# EAGLE design Main_PCB (EAGLE 8.4.1)
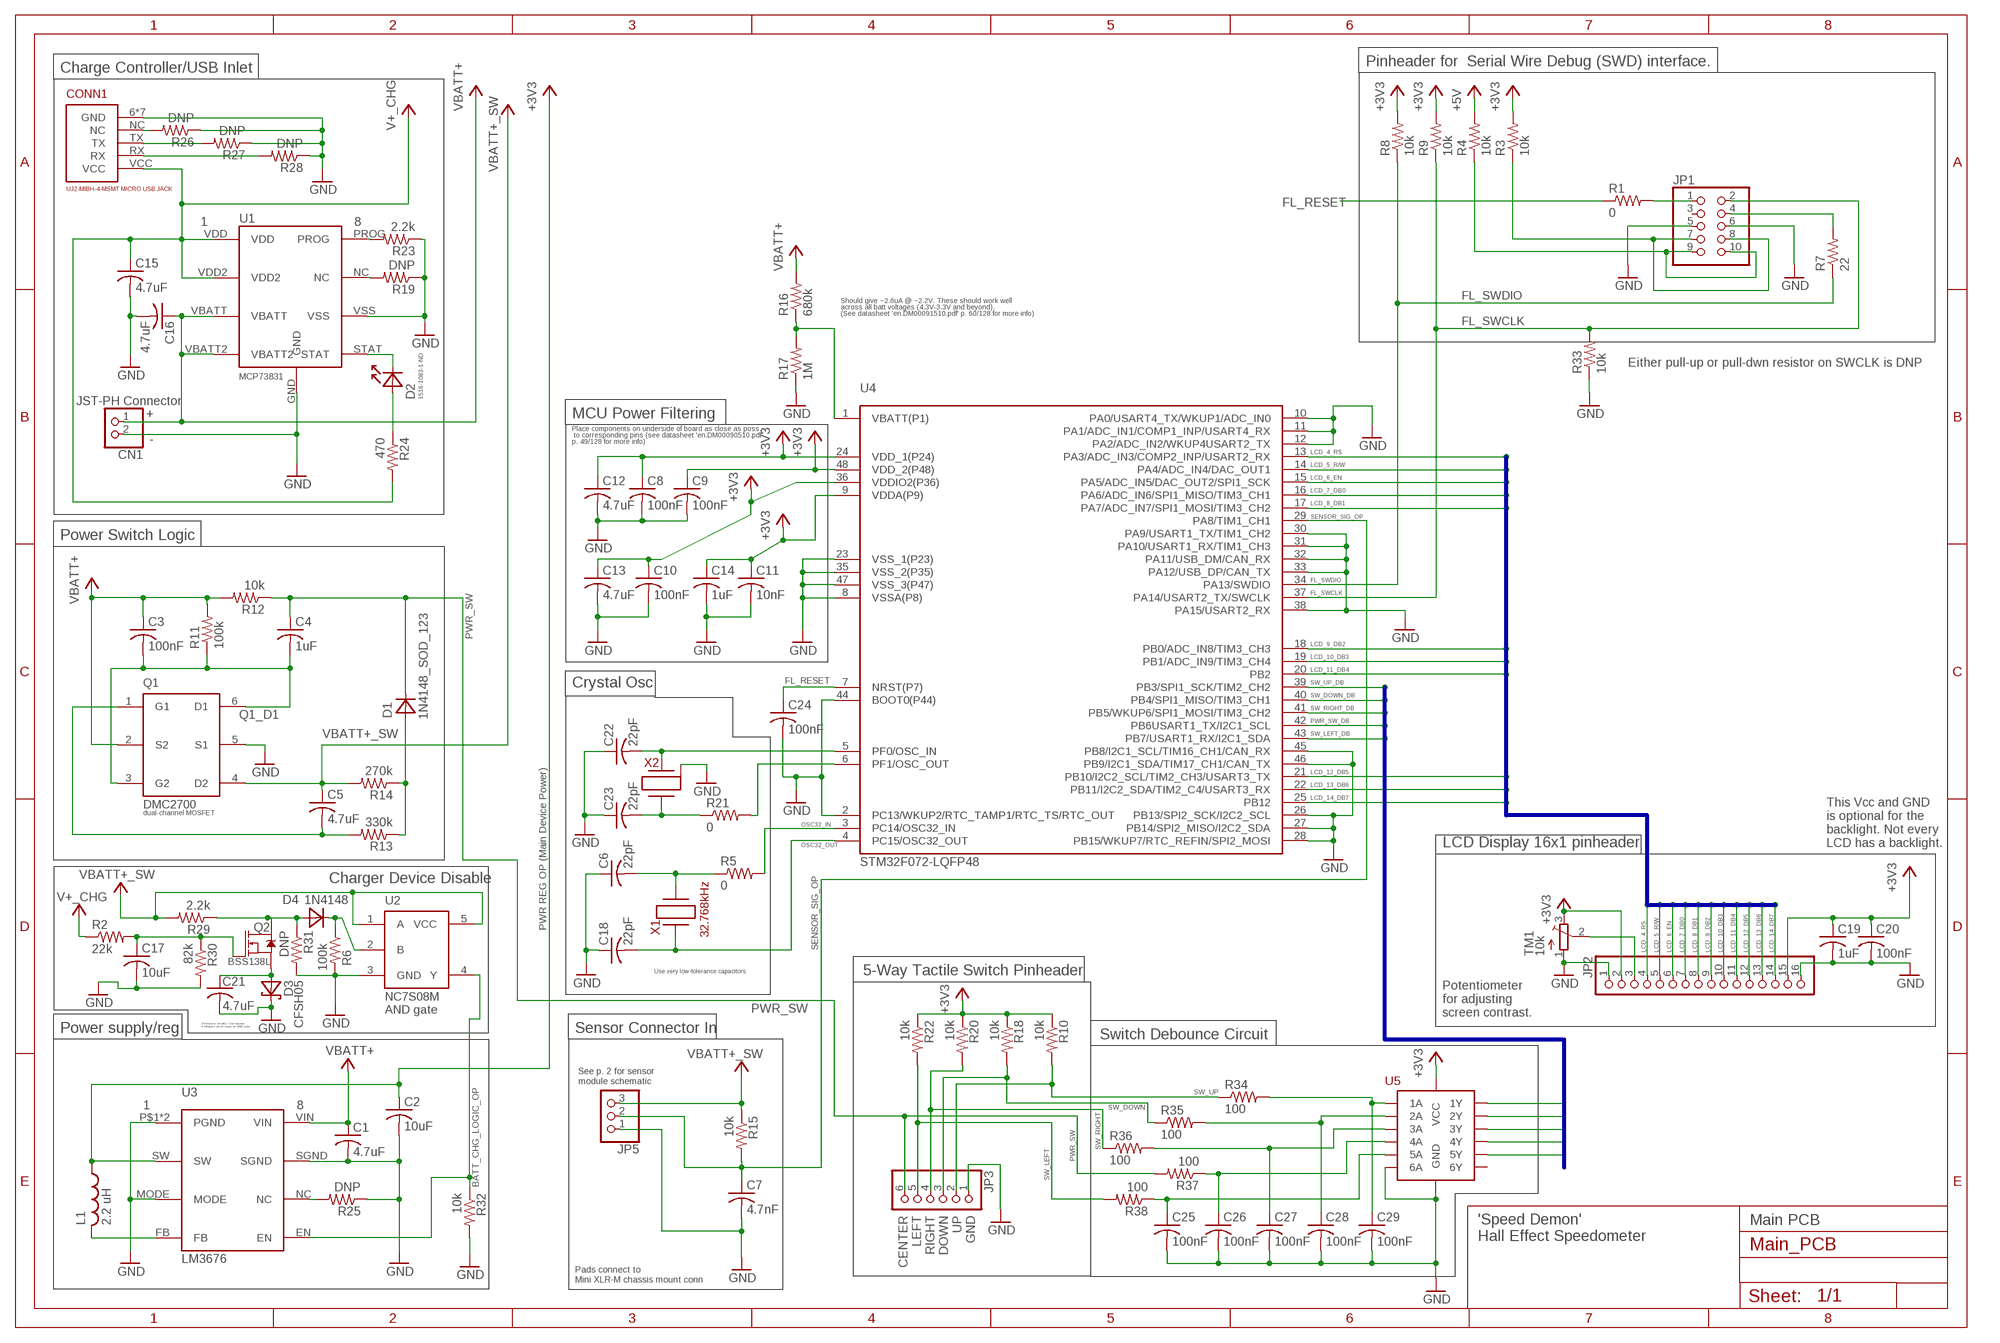
[diagram p0: schematic, sheet 1]

## Parts
C1  4.7uF  C_0805_NP  [C_0805]
C2  10uF  C_0805_NP  [C_0805]
C3  100nF  C_0805_NP  [C_0805]
C4  1uF  C_0805_NP  [C_0805]
C5  4.7uF  C_0805_NP  [C_0805]
C6  22pF  C_0805_NP  [C_0805]
C7  4.7nF  C_0805_NP  [C_0805]
C8  100nF  C_0805_NP  [C_0805]
C9  100nF  C_0805_NP  [C_0805]
C10  100nF  C_0805_NP  [C_0805]
C11  10nF  C_0805_NP  [C_0805]
C12  4.7uF  C_0805_NP  [C_0805]
C13  4.7uF  C_0805_NP  [C_0805]
C14  1uF  C_0805_NP  [C_0805]
C15  4.7uF  C_0805_NP  [C_0805]
C16  4.7uF  C_0805_NP  [C_0805]
C17  10uF  C_0805_NP  [C_0805]
C18  22pF  C_0805_NP  [C_0805]
C19  1uF  C_0805_NP  [C_0805]
C20  100nF  C_0805_NP  [C_0805]
C21  4.7uF  C_0805_NP  [C_0805]
C22  22pF  C_0805_NP  [C_0805]
C23  22pF  C_0805_NP  [C_0805]
C24  100nF  C_0805_NP  [C_0805]
C25  100nF  C_0805_NP  [C_0805]
C26  100nF  C_0805_NP  [C_0805]
C27  100nF  C_0805_NP  [C_0805]
C28  100nF  C_0805_NP  [C_0805]
C29  100nF  C_0805_NP  [C_0805]
CN1  JST_2PIN-SMT-RA  [JST-PH-2-SMT-RA]
CONN1  USB_JACK_102-4008-1-ND_USB-MICRO-B  [USB_JACK_102-4008-1-ND_UJ2-MIBH-4-MSMT-TR]
D1  1N4148_SOD_123  [D_SOD_123]
D2  LED_0805  [LED_0805]
D3  CFSH05  CFSH05_SCHOTTKY  [SOD-882]
D4  1N4148  1N4148_SOD_123  [D_SOD_123]
JP1  PINHD-2X5  [2X05]
JP2  PINHD-1X16  [1X16]
JP3  PINHD-1X6  [1X06]
JP5  PINHD-1X3  [1X03]
L1  2.2 uH  NRS4010T2R2MDGGV  [NONSTANDARD_IND]
Q1  DMC2700  DMC2700_SOT-23-6  [SOT-23-6]
Q2  BSS138L  BSS138LT1_TO-236  [TO-236]
R1  0  R-US_R0805  [R0805]
R2  22k  R_0805  [R_0805]
R3  10k  R-US_R0805  [R0805]
R4  10k  R-US_R0805  [R0805]
R5  0  R-US_R0805  [R0805]
R6  100k  R_0805  [R_0805]
R7  22  R-US_R0805  [R0805]
R8  10k  R-US_R0805  [R0805]
R9  10k  R-US_R0805  [R0805]
R10  10k  R_0805  [R_0805]
R11  100k  R_0805  [R_0805]
R12  10k  R_0805  [R_0805]
R13  330k  R_0805  [R_0805]
R14  270k  R_0805  [R_0805]
R15  10k  R_0805  [R_0805]
R16  680k  R_0805  [R_0805]
R17  1M  R_0805  [R_0805]
R18  10k  R_0805  [R_0805]
R19  DNP  R_0805  [R_0805]
R20  10k  R_0805  [R_0805]
R21  0  R_0805  [R_0805]
R22  10k  R_0805  [R_0805]
R23  2.2k  R_0805  [R_0805]
R24  470  R_0805  [R_0805]
R25  DNP  R_0805  [R_0805]
R26  DNP  R_0805  [R_0805]
R27  DNP  R_0805  [R_0805]
R28  DNP  R_0805  [R_0805]
R29  2.2k  R_0805  [R_0805]
R30  82k  R_0805  [R_0805]
R31  DNP  R_0805  [R_0805]
R32  10k  R_0805  [R_0805]
R33  10k  R-US_R0805  [R0805]
R34  100  R_0805  [R_0805]
R35  100  R_0805  [R_0805]
R36  100  R_0805  [R_0805]
R37  100  R_0805  [R_0805]
R38  100  R_0805  [R_0805]
TM1  10k  TRIMPOT3386  [TRIM-3386]
U1  MCP73831_8-DFN  [8-DFN-(2X3)]
U2  NC7S08M  NC7S08_SOT_23_5  [SOT-23-5]
U3  LM3676  [WSON]
U4  STM32F072-LQFP48  [LQFP48]
U5  SN74LV14A_HEX_SHMITT  [S-PVFQN-N14]
X1  32.768kHz  XC2292CT-ND  [CRYSTAL_OSC_3.2X1.5]
X2  ABM3B-8.000MHZ-10-D-1-G-T  [4-SMD]

## Nets
+3V3: C2.1 C8.1 C9.1 C10.1 C11.1 C12.1 C13.1 C14.1 C19.1 C20.1 JP2.2 JP2.15 L1.P$1 R3.2 R8.2 R9.2 R10.1 R18.1 R20.1 R22.1 TM1.3(E) U3.SW U4.9(VDDA(P9)) U4.24(VDD_1(P24)) U4.36(VDDIO2(P36)) U4.48(VDD_2(P48)) U5.P$14(VCC)
+5V: R4.2
+V+_CHG: C15.1 CONN1.VCC R2.1 R24.2 U1.VDD U1.VDD2 ; supply symbol labelled V+_CHG
BATT_CHG_LOGIC_OP: R32.1 U2.4(Y) U3.EN
FL_RESET: C24.1 R1.1 U4.7(NRST(P7))
FL_SWCLK: JP1.2 R9.1 R33.2 U4.37(PA14/USART2_TX/SWCLK)
FL_SWDIO: R7.1 R8.1 U4.34(PA13/SWDIO)
GND: C1.2 C2.2 C6.1 C7.2 C8.2 C9.2 C10.2 C11.2 C12.2 C13.2 C14.2 C15.2 C16.2 C17.2 C18.1 C19.2 C20.2 C21.2 C22.1 C23.1 C24.2 C25.2 C26.2 C27.2 C28.2 C29.2 CN1.2 CONN1.6(GND) CONN1.7(GND) CONN1.8(GND) CONN1.9(GND) CONN1.10(GND) CONN1.11(GND) CONN1.GND D3.P$2(C) JP1.5 JP1.6 JP2.1 JP2.16 JP3.1 JP5.1 Q1.5(S1) R6.2 R17.1 R19.1 R23.1 R25.1 R26.1 R27.1 R28.1 R30.2 R31.2 R32.2 R33.1 TM1.1(A) U1.GND U1.VSS U2.3(GND) U3.MODE U3.P$1(PGND) U3.PGND U3.SGND U4.2(PC13/WKUP2/RTC_TAMP1/RTC_TS/RTC_OUT) U4.8(VSSA(P8)) U4.10(PA0/USART4_TX/WKUP1/ADC_IN0) U4.11(PA1/ADC_IN1/COMP1_INP/USART4_RX) U4.12(PA2/ADC_IN2/WKUP4USART2_TX) U4.23(VSS_1(P23)) U4.26(PB13/SPI2_SCK/I2C2_SCL) U4.27(PB14/SPI2_MISO/I2C2_SDA) U4.28(PB15/WKUP7/RTC_REFIN/SPI2_MOSI) U4.30(PA9/USART1_TX/TIM1_CH2) U4.31(PA10/USART1_RX/TIM1_CH3) U4.32(PA11/USB_DM/CAN_RX) U4.33(PA12/USB_DP/CAN_TX) U4.35(VSS_2(P35)) U4.38(PA15/USART2_RX) U4.44(BOOT0(P44)) U4.45(PB8/I2C1_SCL/TIM16_CH1/CAN_RX) U4.46(PB9/I2C1_SDA/TIM17_CH1/CAN_TX) U4.47(VSS_3(P47)) U5.GND U5.P$7(GND) U5.P$13(6A) X2.P$02 X2.P$04
LCD_4_RS: JP2.4 U4.13(PA3/ADC_IN3/COMP2_INP/USART2_RX)
LCD_5_R/W: JP2.5 U4.14(PA4/ADC_IN4/DAC_OUT1)
LCD_6_EN: JP2.6 U4.15(PA5/ADC_IN5/DAC_OUT2/SPI1_SCK)
LCD_7_DB0: JP2.7 U4.16(PA6/ADC_IN6/SPI1_MISO/TIM3_CH1)
LCD_8_DB1: JP2.8 U4.17(PA7/ADC_IN7/SPI1_MOSI/TIM3_CH2)
LCD_9_DB2: JP2.9 U4.18(PB0/ADC_IN8/TIM3_CH3)
LCD_10_DB3: JP2.10 U4.19(PB1/ADC_IN9/TIM3_CH4)
LCD_11_DB4: JP2.11 U4.20(PB2)
LCD_12_DB5: JP2.12 U4.21(PB10/I2C2_SCL/TIM2_CH3/USART3_TX)
LCD_13_DB6: JP2.13 U4.22(PB11/I2C2_SDA/TIM2_C4/USART3_RX)
LCD_14_DB7: JP2.14 U4.25(PB12)
N$1: C5.2 Q1.1(G1) R13.2
N$2: JP1.1 R1.2
N$3: JP1.9 JP1.10 R4.1
N$5: R5.2 U4.3(PC14/OSC32_IN)
N$6: JP1.7 JP1.8 R3.1
N$7: R16.1 R17.2 U4.1(VBATT(P1))
N$9: JP1.4 R7.2
N$10: L1.P$2 U3.FB
N$11: D4.2(C) R6.1 U2.2(B)
N$13: R21.2 U4.6(PF1/OSC_OUT)
N$14: JP2.3 TM1.2(S)
N$15: D1.1(A) R13.1 R14.1
N$16: C17.1 Q2.1(G) R2.2 R30.1
N$17: C22.2 U4.5(PF0/OSC_IN) X2.P$01
N$18: C23.2 R21.1 X2.P$03
N$19: D4.1(A) Q2.3(D) R29.1 R31.1
N$20: C21.1 D3.P$1(A) Q2.2(S)
N$21: C25.1 R38.1 U5.P$11(5A)
N$22: C26.1 R37.1 U5.P$9(4A)
N$23: C27.1 R36.2 U5.P$5(3A)
N$24: C28.1 R35.2 U5.P$3(2A)
N$26: C29.1 R34.2 U5.P$1(1A)
N$31: D2.2(C) U1.STAT
N$32: R19.2 U1.NC
N$33: D2.1(A) R24.1
N$34: R23.2 U1.PROG
N$35: R25.2 U3.NC
N$36: CONN1.NC R26.2
N$38: CONN1.TX R27.2
N$39: CONN1.RX R28.2
OSC32_IN: C6.2 R5.1 X1.P$1
OSC32_OUT: C18.2 U4.4(PC15/OSC32_OUT) X1.P$2
PWR_SW: C4.1 D1.2(C) JP3.6 R12.1 R37.2
PWR_SW_DB: U4.42(PB6USART1_TX/I2C1_SCL) U5.P$8(4Y)
Q1_D1: C3.2 C4.2 Q1.3(G2) Q1.6(D1) R11.1
SENSOR_SIG_OP: C7.1 JP5.2 R15.2 U4.29(PA8/TIM1_CH1)
SW_DOWN: JP3.3 R18.2 R35.1
SW_DOWN_DB: U4.40(PB4/SPI1_MISO/TIM3_CH1) U5.P$4(2Y)
SW_LEFT: JP3.5 R22.2 R38.2
SW_LEFT_DB: U4.43(PB7/USART1_RX/I2C1_SDA) U5.P$10(5Y)
SW_RIGHT: JP3.4 R20.2 R36.1
SW_RIGHT_DB: U4.41(PB5/WKUP6/SPI1_MOSI/TIM3_CH2) U5.P$6(3Y)
SW_UP: JP3.2 R10.2 R34.1
SW_UP_DB: U4.39(PB3/SPI1_SCK/TIM2_CH2) U5.P$2(1Y)
VBATT+: C1.1 C3.1 C16.1 CN1.1 Q1.2(S2) R11.2 R12.2 R16.2 U1.VBATT U1.VBATT2 U3.VIN
VBATT+_SW: C5.1 JP5.3 Q1.4(D2) R14.2 R15.1 R29.2 U2.1(A) U2.5(VCC)
Unconnected: JP1.3 U5.P$12(6Y)

## Buses
LCD_4_RS,LCD_5_R/W,LCD_6_EN,LCD_7_DB0,LCD_8_DB1,LCD_9_DB2,LCD_10_DB3,LCD_11_DB4,LCD_12_DB5,LCD_13_DB6,LCD_14_DB7
SW_UP_DB,SW_DOWN_DB,SW_RIGHT_DB,SW_LEFT_DB,PWR_SW_DB

## Notes on the sheet
- Pinheader for  Serial Wire Debug (SWD) interface.
- Charge Controller/USB Inlet
- Should give ~2.6uA @ ~2.2V. These should work well
- across all batt voltages (4.3V-3.3V and beyond).
- (See datasheet 'en.DM00091510.pdf' p. 60/128 for more info)
- Either pull-up or pull-dwn resistor on SWCLK is DNP
- JST-PH Connector
- + | MCU Power Filtering
- Place components on underside of board as close as poss.
- to corresponding pins (see datasheet 'en.DM00090510.pdf'
- - | p. 49/128 for more info)
- Power Switch Logic
- Crystal Osc
- dual-channel MOSFET
- LCD Display 16x1 pinheader
- This Vcc and GND
  is optional for the
  backlight. Not every
  LCD has a backlight.
- Charger Device Disable
- PWR REG OP (Main Device Power)
- Use very low-tolerance capacitors.
- 5-Way Tactile Switch Pinheader
- Potentiometer
  for adjusting
  screen contrast.
- Debounce circuitry. Can bypass
  if voltages out of range for AND gate.
- Power supply/reg | Sensor Connector In
- Switch Debounce Circuit
- See p. 2 for sensor
  module schematic
- CENTER
  LEFT
  RIGHT
  DOWN
  UP
  GND
- Main PCB
- 'Speed Demon'
  Hall Effect Speedometer
- Pads connect to
  Mini XLR-M chassis mount conn

## Library data of the parts
C1-C5 C7-C17 C19-C21 C24-C29 = 0805_generics:C_0805_NP: generic capacitor in 0805 package
C6 C18 C22 C23 = LCRD_SMD_generics:C_0805_NP: generic capacitor in 0805 package
CN1 = adafruit:JST_2PIN: JST 2-Pin Connectors of various flavors SMT-RA (S2B-PH-SM4) 4UConnector #17311 SMT (B2B-PH-SM4) THM-RA (S2B-PH) THM (B2B-PH)
CONN1 = USB_micro_jack:USB_JACK_102-4008-1-ND_USB-MICRO-B
D1 D4 = LCRD_SMD_generics:1N4148_SOD_123
D2 = LCRD_SMD_generics:LED_0805
D3 = LCRD_SMD_generics:CFSH05_SCHOTTKY: schottky diode
JP1 = pinhead:PINHD-2X5: PIN HEADER
JP2 = pinhead:PINHD-1X16: PIN HEADER
JP3 = pinhead:PINHD-1X6: PIN HEADER
JP5 = pinhead:PINHD-1X3: PIN HEADER
L1 = LCRD_SMD_generics:NRS4010T2R2MDGGV: 2.2 uH inductor
Q1 = DMC2700:DMC2700_SOT-23-6
Q2 = DMC2700:BSS138LT1_TO-236
R1 R3-R5 R7-R9 R33 = rcl:R-US_: RESISTOR, American symbol
R2 R6 R10-R20 R22-R32 R34-R38 = 0805_generics:R_0805
R21 = LCRD_SMD_generics:R_0805
TM1 = adafruit:TRIMPOT: SMT trimmer potentiometer part number TC33X http://www.ladyada.net/library/eagle
U1 = mcp73831:MCP73831_8-DFN
U2 = DMC2700:NC7S08_SOT_23_5
U3 = LM3676:LM3676: Switching Power Regulator. LM3676 Created by Nathaniel Dusciuc (10/20/2017) for ECE411.
U4 = stm32f0:STM32F072
U5 = DMC2700:SN74LV14A_HEX_SHMITT
X1 = LCRD_SMD_generics:XC2292CT-ND: 32.768KHz crystal oscillator with 5ppm tolerance (~.0005% error) Part name is Digi-key part #. Mfr. Part # is ECS-.327-CDX-1293 load capacitance = 12.5pF To determine ext capacitors use fmla: CL = [(CL1 * CL@)/(CL1+CL2)] + Cs where Cs is stray capacitance from PCB
X2 = LCRD_SMD_generics:ABM3B-8.000MHZ-10-D-1-G-T: 8 MHZ crystal oscilator. CL = 10pF, ESR = 200 ohm

## Board
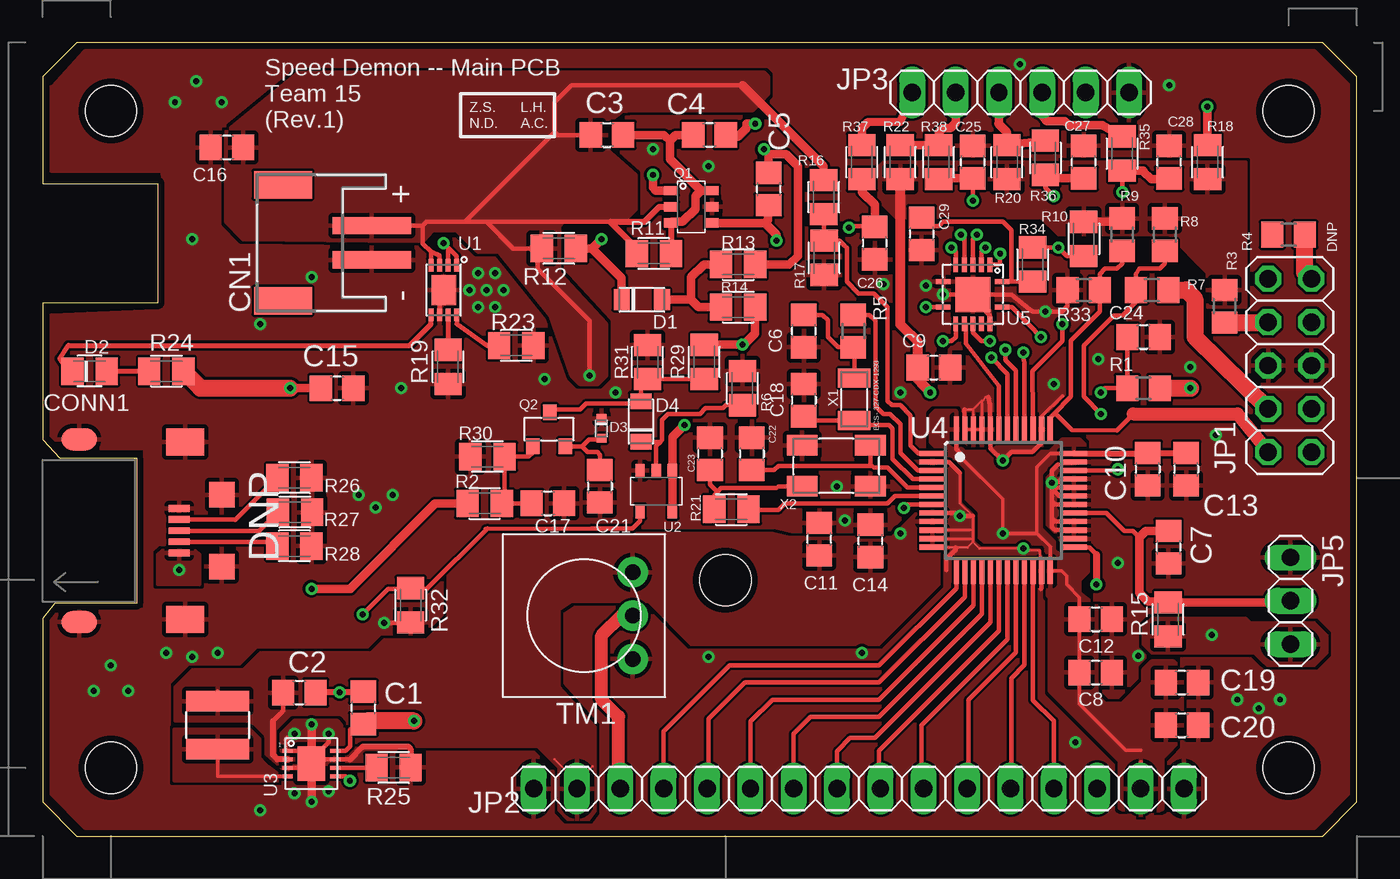
[diagram p1: board, top side]
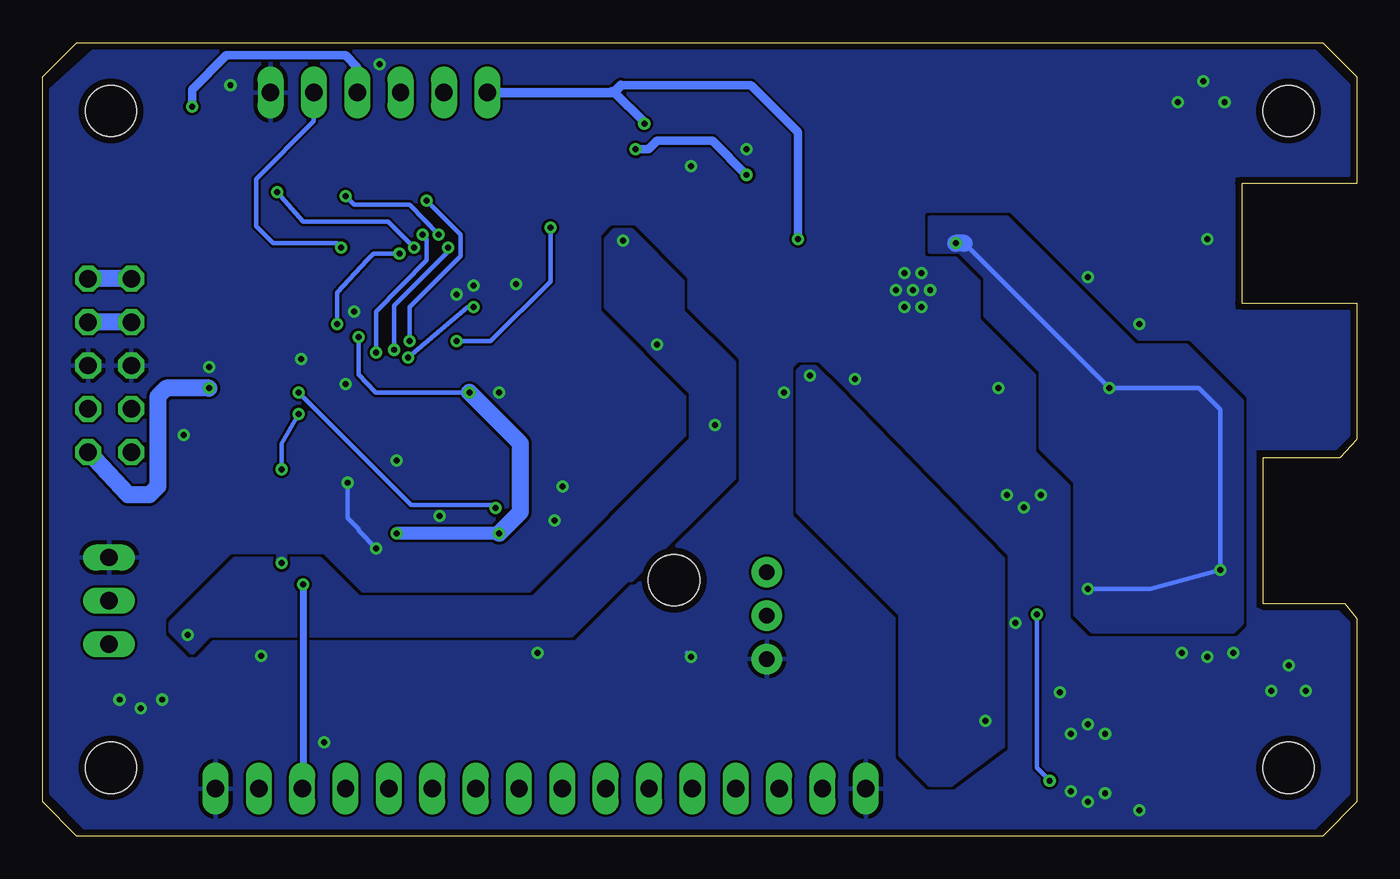
[diagram p2: board, bottom side, seen from below]

Size 77 x 46.5 mm. Coordinates in mm from the lower left corner, seen from the top.
Outline: 0,2 2,0 75,0 77,2 77,44.5 75,46.5 2,46.5 1,45.5 0,44.5 0,38.25 6.75,38.25 6.75,31.25 0,31.25 0,23.25 1,22.15 5.5,22.15 5.5,13.65 0.7,13.65 0,12.75 0,2
Copper layers (1*16): Top 0.0356mm / dielectric 1.5011mm / Bottom 0.0356mm
Design rules "LaenPCBOrder *": minimum track width 6mil, minimum drill 13mil, track to track 6mil, track to pad 6mil, pad to pad 6mil, via to via 6mil, smd to smd 6mil, copper to edge 15mil, drill to drill 6mil, minimum pad ring 7mil, minimum via ring 7mil, stop-mask expansion 3mil, vias tented up to drill 0mil, thermal gap 10mil
Holes 3 mm at 4,4 4,42.5 73,42.5 73,4 40,15

### Footprints (pad centres in the part's own frame; a part is rotated, then mirrored left to right if it is on the bottom)
C_0805 = smd 1.3 x 1.5: 1 -0.95,0; 2 0.95,0
JST-PH-2-SMT-RA = smd 1 x 4.6: 1 1,-3.7; 2 -1,-3.7 | smd 1.6 x 3.4: NC1 -3.4,1.5; NC2 3.4,1.5
USB_JACK_102-4008-1-ND_UJ2-MIBH-4-MSMT-TR = smd 2.1 x 1.3: 6 0,5.35; 11 0,-5.35 | smd 2.2 x 1.6: 7 6.2,5.2; 10 6.2,-5.2 | smd 1.5 x 1.5: 8 8.35,2.1; 9 8.35,-2.1 | smd 1.25 x 0.4: GND 5.85,1.3; NC 5.85,0.65; RX 5.85,-0.65; TX 5.85,0; VCC 5.85,-1.3
D_SOD_123 = smd 0.914 x 1.219: 1 -1.181,0; 2 1.181,0
LED_0805 = smd 1.3 x 1.6: 1 -1,0; 2 1,0
SOD-882 = smd 0.5 x 0.6: P$1 -0.575,0; P$2 0.575,0
2X05 = drill 1.016 octagon: 1 -5.08,-1.27; 2 -5.08,1.27; 3 -2.54,-1.27; 4 -2.54,1.27; 5 0,-1.27; 6 0,1.27; 7 2.54,-1.27; 8 2.54,1.27; 9 5.08,-1.27; 10 5.08,1.27
1X16 = drill 1.016 long: 1 -19.05,0; 2 -16.51,0; 3 -13.97,0; 4 -11.43,0; 5 -8.89,0; 6 -6.35,0; 7 -3.81,0; 8 -1.27,0; 9 1.27,0; 10 3.81,0; 11 6.35,0; 12 8.89,0; 13 11.43,0; 14 13.97,0; 15 16.51,0; 16 19.05,0
1X06 = drill 1.016 long: 1 -6.35,0; 2 -3.81,0; 3 -1.27,0; 4 1.27,0; 5 3.81,0; 6 6.35,0
1X03 = drill 1.016 long: 1 -2.54,0; 2 0,0; 3 2.54,0
NONSTANDARD_IND = smd 1.2 x 3.7: P$1 -1.4,0; P$2 1.4,0
SOT-23-6 = smd 0.55 x 0.8: 1 -0.95,-1.2; 2 0,-1.2; 3 0.95,-1.2; 4 0.95,1.2; 5 0,1.2; 6 -0.95,1.2
TO-236 = smd 0.8 x 0.9: 1 -0.95,-1; 2 0.95,-1; 3 0.05,1
R0805 = smd 1.3 x 1.5: 1 -0.95,0; 2 0.95,0
R_0805 = smd 1.3 x 1.6: 1 -1,0; 2 1,0
TRIM-3386 = drill 0.9 pad 1.778: 1 -2.54,-2.857; 2 0,-2.857; 3 2.54,-2.857
8-DFN-(2X3) = smd 1.45 x 1.75: GND 0,0 | smd 0.3 x 0.75: NC -0.25,1.45; PROG -0.75,1.45; STAT 0.75,1.45; VBATT 0.25,-1.45; VBATT2 0.75,-1.45; VDD -0.75,-1.45; VDD2 -0.25,-1.45; VSS 0.25,1.45
SOT-23-5 = smd 0.55 x 0.8: 1 -0.95,-1.2; 2 0,-1.2; 3 0.95,-1.2; 4 0.95,1.2; 5 -0.95,1.2
WSON = smd 0.6 x 0.25: EN 1.4,-0.75; FB -1.4,-0.75; MODE -1.4,-0.25; NC 1.4,-0.25; PGND -1.4,0.75; SGND 1.4,0.25; SW -1.4,0.25; VIN 1.4,0.75 | smd 1.6 x 2: P$1 0,0
LQFP48 = smd 1.5 x 0.3: 1 -4.15,2.75; 2 -4.15,2.25; 3 -4.15,1.75; 4 -4.15,1.25; 5 -4.15,0.75; 6 -4.15,0.25; 7 -4.15,-0.25; 8 -4.15,-0.75; 9 -4.15,-1.25; 10 -4.15,-1.75; 11 -4.15,-2.25; 12 -4.15,-2.75; 25 4.15,-2.75; 26 4.15,-2.25; 27 4.15,-1.75; 28 4.15,-1.25; 29 4.15,-0.75; 30 4.15,-0.25; 31 4.15,0.25; 32 4.15,0.75; 33 4.15,1.25; 34 4.15,1.75; 35 4.15,2.25; 36 4.15,2.75 | smd 0.3 x 1.5: 13 -2.75,-4.15; 14 -2.25,-4.15; 15 -1.75,-4.15; 16 -1.25,-4.15; 17 -0.75,-4.15; 18 -0.25,-4.15; 19 0.25,-4.15; 20 0.75,-4.15; 21 1.25,-4.15; 22 1.75,-4.15; 23 2.25,-4.15; 24 2.75,-4.15; 37 2.75,4.15; 38 2.25,4.15; 39 1.75,4.15; 40 1.25,4.15; 41 0.75,4.15; 42 0.25,4.15; 43 -0.25,4.15; 44 -0.75,4.15; 45 -1.25,4.15; 46 -1.75,4.15; 47 -2.25,4.15; 48 -2.75,4.15
S-PVFQN-N14 = smd 2.05 x 2.05: GND 0,0 | smd 0.28 x 0.85: P$1 -0.75,1.725; P$7 -0.75,-1.725; P$8 0.75,-1.725; P$14 0.75,1.725 | smd 0.85 x 0.28: P$2 -1.725,1; P$3 -1.725,0.5; P$4 -1.725,0; P$5 -1.725,-0.5; P$6 -1.725,-1; P$9 1.725,-1; P$10 1.725,-0.5; P$11 1.725,0; P$12 1.725,0.5; P$13 1.725,1
CRYSTAL_OSC_3.2X1.5 = smd 1.1 x 1.9: P$1 1.25,0; P$2 -1.25,0
4-SMD = smd 1.8 x 1.2: P$01 -2,-1.2; P$02 2,-1.2; P$03 2,1.2; P$04 -2,1.2

### Placement (x,y rotation side)
C1  18.79,7.52 90 top
C2  15.04,8.41 0 top
C3  33.06,41.09 0 top
C4  39.07,41.09 180 top
C5  42.54,37.92 90 top
C6  44.6,29.6 90 top
C7  65.96,16.93 270 top
C8  61.7,9.59 0 top
C9  52.22,27.46 0 top
C10  64.75,21.5 270 top
C11  45.5,17.4 90 top
C12  61.7,12.71 0 top
C13  67,21.5 270 top
C14  48.5,17.3 90 top
C15  17.25,26.25 0 top
C16  10.8,40.35 180 top
C17  29.6,19.5 0 top
C18  44.6,25.55 270 top
C19  66.75,9 0 top
C20  66.75,6.5 0 top
C21  32.65,20.5 270 top
C22  41.55,22.4 270 top
C23  39.1,22.4 270 top
C24  64.5,29.25 0 top
C25  54.5,39.5 90 top
C26  48.75,34.75 270 top
C27  61,39.5 90 top
C28  66,39.5 90 top
C29  51.5,35.3 270 top
CN1  15.58,34.77 90 top
CONN1  2.15,17.9 0 top
D1  35.11,31.44 180 top
D2  2.75,27.25 180 top
D3  32.75,23.9 90 top
D4  35.05,24.3 270 top
JP1  73.07,27.58 90 top
JP2  47.82,2.78 0 top
JP3  57.3,43.58 180 top
JP5  73.11,13.79 270 top
L1  10.25,6.5 270 top
Q1  38.01,36.88 270 top
Q2  29.67,23.84 0 top
R1  64.5,26.25 0 top
R2  25.9,19.5 0 top
R3  69.25,31.05 90 top
R4  73,35.25 180 top
R5  47.5,29.6 90 top
R6  41,26.25 90 top
R7  65,32 0 top
R8  65.75,35.25 90 top
R9  63.25,35.25 90 top
R10  61,35 270 top
R11  35.81,34.14 180 top
R12  30.24,34.44 180 top
R13  40.75,33.5 0 top
R14  40.75,31 0 top
R15  65.94,12.7 90 top
R16  45.77,37.45 90 top
R17  45.79,33.89 90 top
R18  68.25,39.5 90 top
R19  23.75,27.5 90 top
R20  56.5,39.5 90 top
R21  40.35,19.15 0 top
R22  50.25,39.5 90 top
R23  27.75,28.75 180 top
R24  7.25,27.25 0 top
R25  20.56,4.02 180 top
R26  14.75,21 180 top
R27  14.78,18.98 180 top
R28  14.75,17 180 top
R29  38.77,27.79 90 top
R30  26.06,22.24 180 top
R31  35.44,27.78 90 top
R32  21.56,13.53 270 top
R33  61,32 0 top
R34  58,33.5 270 top
R35  63.25,40 270 top
R36  58.75,39.75 270 top
R37  48,39.5 90 top
R38  52.5,39.5 90 top
TM1  31.71,12.92 90 top
U1  23.5,32 180 top
U2  35.95,20.22 180 top
U3  15.75,4.25 0 top
U4  56.28,19.68 0 top
U5  54.5,31.75 270 top
X1  47.55,25.6 90 top
X2  46.5,21.7 180 top

### Tracks (layer width: path | path; a pad name or v marks a point on that pad's centre or on a via)
+3V3  (via drill 0.35)
  Top 0.152: 30,4.5 31.31,3.19 31.31,3 | 32.21,4.09 31.93,3.81 31.8,3.68 31.8,3.63
  Top 0.2: 58.25,17.75 v56.25,17.75 56.25,19.75 53.75,22.25 53.75,22.46 | 58.25,17.75 58.25,21.63 59.06,22.43 U4.36 | 58.25,17.75 59.03,16.97 U4.24 59.72,15.53 60,15.25 60,14.75 60.75,14 C12.1 C8.1 60.75,7.75 63.47,5.03 64.33,5.03 | C2.1 14.25,8.5 | 10.25,8.5 L1.P$1 | 14.23,4.62 U3.SW | 31.31,3 JP2.2
  Top 0.203: 59,15.5 U4.24 | JP2.2 31.31,3.19 31.93,3.81
  Top 0.25: U4.36 | 64.73,22.43 C10.1 | C14.1 48.55,16.5 | U4.48 53.53,22.68 53.75,22.46 | 13.5,6.75 14.09,7.34 C2.1 | 64.33,4.32 JP2.15 | v58.5,29.25 57.05,30.75 56.8,31 U5.P$14 | R9.2 63.05,36
  Top 0.35: U4.36 64.73,22.43 | C10.1 C13.1 | U3.SW 13.75,4.5 13.5,4.75 13.5,6.75
  Top 0.5: 63.05,36 R10.1
  Top 0.6: R22.1 50.25,30 50.35,29.89 51.27,28.97 C9.1 51.27,26.77 v52,26
  Bottom 0.25: v52,26 57.5,26 58.5,27.05 v58.5,29.25
  Bottom 0.75: v50.25,17.75 v56.25,17.75
  Bottom 1: v50.25,17.75 49,19 49,23 v52,26
  pour Top (rank 2): 42.75,17.75 27,17.75 26.81,17.75 26.54,17.74 26.25,17.74 23.75,15.25 23.75,12.75 22.5,11.5 20,11.5 19.25,10.75 12.75,10.75 11.75,9.75 8.75,9.75 7.75,8.75 7.75,6.75 12.15,6.75 13.1,5.8 13.1,4.8 13.75,4.25 14,4.25 14.75,3.25 20.5,3.25 20.5,5.25 29,5.25 30.25,4 30.25,1.5 30.75,1 32,1 32.35,1.45 32.35,6.4 30.25,8.75 30.25,13.25 31,13.75 35.5,13.75 38,11.25 49,11.25 52.5,14.75 52.5,19 51.25,19 49.75,17.5 43.75,17.5
  pour Top (rank 2): 53.6,22.9 53.6,24.8 53.5,24.9 52.3,24.9 52.05,24.65 52.05,23.1 52.35,22.8 53.05,22.8 53.15,22.7 53.15,16.6 53.25,16.5 58.75,16.5 58.9,16.35 58.9,14.1 59,14 59,8.5 63.1,4.4 63.1,1.65 64,1.25 64.75,1.25 65.6,1.6 65.6,4.6 66.75,5.75 66.75,9.75 66.25,10.25 65,10.25 64.5,9.75 64.5,9 63.25,7.75 62.25,7.75 61.75,8.25 61.75,13.5 60.75,14.25 60.75,15 61.25,15.5 61.25,16.5 59.5,16.5 59.25,16.75 59.25,17.25 58.5,18 58.5,21.25 59.6,22.35 60.85,22.35 61.25,22.75 60.75,23.25 59.75,23.25 59,22.5 54,22.5
  pour Top: 66,35.25 59.5,35.25 58.5,36.25 50,36.25 49,37.25 49,39.25 49.25,39.5 70.5,39.5 70.5,31 68.25,31 68.25,33
+V+_CHG  (via drill 0.35)
  Top 0.25: U1.VDD2 23.75,34.5 v23.5,34.75 24.25,34 U1.VDD | 7.97,15.63 v8,15.6
  Top 0.5: v14.5,26.25 C15.1 | v15.75,14.5 18,14.5 | 18,14.5 18.03,14.5 | 18,14.5 23,19.5 R2.1
  Top 1: R24.2 9.25,26.25 v14.5,26.25
  Bottom 0.25: v15.75,14.5 12.1,14.5 v8,15.6 8,25 9.25,26.25 v14.5,26.25 23,34.75
  Bottom 1: 23,34.75 v23.5,34.75
  pour Bottom: 16.5,20.75 16.5,13 15.5,12 7.25,12 6.75,12.5 6.75,25.5 10,28.75 13,28.75 20.5,36.25 25,36.25 25,34.25 23.25,34.25 21.75,32.75 21.75,30.5 18.5,27.25 18.5,22.75
  pour Top: 7,16.75 8.95,16.75 9.2,16.5 9.2,14.75 6.75,14.75 6.75,16.5
BATT_CHG_LOGIC_OP  (via drill 0.35)
  Top 0.25: U2.4 34.99,18.46 34.57,18.04 32.17,18.03 25.95,18.01 26.06,18.02 22.5,14.5 R32.1 21.53,14.5 20.25,14.5 v18.75,13 | U3.EN 17.75,3.5 v18,3.25
  Bottom 0.25: v18.75,13 18.75,4 v18,3.25
FL_RESET  (via drill 0.35)
  Top 0.25: v62,26 62.25,26.25 R1.1 C24.1 | v50.47,19.22 50.68,19.43 U4.7
  Bottom 0.152: v50.47,19.22 50.66,19.42 50.64,19.4
  Bottom 0.25: v62,26 55.4,19.4 50.64,19.4
FL_SWCLK
  Top 0.25: 59.25,24.75 60.25,25.75 60.25,29.05 61.95,30.75 R33.2 61.95,32.95 62.25,33.25 62.95,33.25 63.25,33.55 R9.1 | 59.25,24.75 59,24.5 59,23.86 U4.37 | 59.25,24.75 59.36,24.75 60.3,23.79 62.92,23.78 63.89,24.75
  Top 0.75: 63.89,24.75 70,24.75 JP1.2
FL_SWDIO  (via drill 0.35)
  Top 0.25: v62,24.75 61,25.75 61,28.75 62.75,30.5 63.25,30.5 64.05,31.3 R7.1 64.05,32.95 64.25,33.25 65.45,33.25 65.75,33.55 R8.1 | v63,21.5 62.68,21.43 U4.34
  Bottom 0.25: v62,24.75 63,23 v63,21.5
GND  (via drill 0.35)
  Top 0.152: U4.23 58.53,16.22 58.5,16.25 58.5,16.35 58.43,16.43 58.43,16.72 58.4,16.75 57.57,16.75 v57.46,16.86 54.89,16.86 54.5,17.25 | 54.5,17.5 54.5,18 | 54.5,17.5 54.5,17.25 | 54.5,18 54.5,18.75 53.75,19.5 53.75,21.27 | 59.48,21.77 59.55,21.77 59.59,21.81 60.31,21.81 U4.35 | U4.10 54.43,17.93 54.5,18 | U4.12 54.18,16.93 54.5,17.25 | U4.11 54.43,17.43 54.5,17.5 | U4.46 54.53,24.97 54.5,25 | 54.5,25 54,25 | 55.03,25.47 U4.45 | 55.03,25.47 55,25.5 54.5,25 | 55.42,25.72 55.28,25.72 55.03,25.47 | U4.46 U4.45 | U4.46 U4.47
  Top 0.2: U3.PGND 14.25,5.1 14.25,5.64 | U4.38 58.53,24.59 59.74,25.8 59.77,25.8
  Top 0.25: U3.P$1 16.25,4.25 16.5,4.5 U3.SGND 18,4.5 | U3.MODE 15,4 15.25,4.25 U3.P$1 | U3.P$1 15.75,3.38 | U1.VSS 23.25,31.5 23.5,31.75 U1.GND | v59.13,20.71 59.13,21.42 59.48,21.77 | 55.53,24.47 55.5,24.5 55.5,25.28 55.42,25.72 | 56.53,22.28 v56.25,22 | U4.38 58.53,23.03 58,22.5 56.75,22.5 v56.25,22 | v59.13,20.71 59.47,20.71 59.69,20.93 U4.33 | v59.13,20.71 59.13,20.37 | U4.31 59.57,19.93 59.56,19.93 59.25,20.25 | 59.13,20.37 59.25,20.25 | 59.25,20.25 59.43,20.43 U4.32 | 59.13,20.37 59.13,19.62 | U4.30 59.32,19.43 59.13,19.62 | 59.13,19.62 59.13,18.62 | U4.28 59.32,18.43 59.13,18.62 | 59.13,18.62 59.13,18.12 59.32,17.93 U4.27 | 53.75,21.27 53.09,21.93 U4.2 | v56.25,22 55.53,22.72 U4.44 | 18.73,8.41 C1.2 | 14.94,5 U3.PGND | 54.5,18.75 v53.75,18.75 53.57,18.93 U4.8 | U4.23 58.53,14.53 58.5,14.5 | 53.5,16.93 53.5,16.8 52.95,16.25 52.95,15.6 | 21.56,4.44 R25.1 | 14.25,5.64 14.61,6 v14.75,6 | v16.75,6 16.75,5.5 15.75,4.5 U3.P$1 | R32.2 21.53,12.5 v20,12.5 | U4.45 | U4.47 54,23.86 54,25 | 54.25,31.75 v52.75,31.75 | 54.25,31.75 U5.GND 56.75,31.75 58,30.75 v58.75,30.75 59.75,30.75 60.05,31.05 R33.1 | U5.P$13 55.5,30.5 54.25,31.75
  Top 0.35: 18,4.5 18.75,5.25 21.42,5.25 21.56,5.11 21.56,4.44 | C2.2 v17.39,8.42 18.74,8.42 C1.2
  Top 0.5: v15.75,2 U3.P$1 v15.75,6.56
  Bottom 0.25: v57.46,16.86 58.5,17.9 58.5,18 59.13,18.63 v59.13,20.71 | v39,10.5 39.25,10.75
  other vias: 16.75,2.62 25,32 26,32 27,32 9,44.25 8.75,35 12.75,1.5 14.75,2.5 19.5,19.25 21,26.25 71.25,7.5 25.5,33 25.5,31 26.5,31 26.5,33 7.75,43 10.5,43 20.5,20 18.5,20 46.54,20.48 72.5,8 70,8 3,8.5 4,10 5,8.5 68.75,23.5 8.75,10.5 10.25,10.75 7.25,10.75 12.75,30 15.75,32.75 48,10.75 63,16 39,39.25 33.57,25.99 67.25,27.5 29.4,26.8 47,18.5 66,44 57.25,45.25 64.2,10.55 60.5,5.5 49.25,32.35 51.75,32.25 59.25,26.5 50.25,26 61.85,27.95 35.75,40.25
  pour Bottom (rank 3): 2.5,0.5 0.5,2.5 0.5,12.5 1.25,13.25 6,13.25 6,22.75 1.25,22.75 0.5,23.5 0.5,30.75 7.25,30.75 7.25,38.75 0.5,38.75 0.5,44 2.5,46 74,46 76.5,43.75 76.5,2.5 74.5,0.5
  pour Top (rank 3): 0.5,23.5 0.5,30.5 6,30.75 7.25,31 7.25,37.75 7,39 0.5,39 0.5,43.9 0.6,43.9 2.5,46 74.5,46 76.5,44 76.5,2.5 74.5,0.5 2.5,0.5 0.5,2.5 0.5,13 0.75,13.25 6,13.25 6,22.75 1.25,22.75
  pour Top: 53.25,21.75 53.75,21.25 53.75,19.5 54.5,18.75 54.5,17.25 54.9,16.85 57.5,16.85 57.6,16.75 58.35,16.75 58.4,16.7 58.4,16.45 58.5,16.35 58.5,16.2 58.1,16.6 53.15,16.6 52.8,16.95 53.15,17.3 53.15,17.8 53.15,21.65
  pour Top: 17.5,4.5 17.5,6.5 17.25,6.75 14.75,6.75 14,6 14,5 15.25,5 15.75,4.5
LCD_4_RS
  Top 0.25: U4.13 53.53,14.53 49,10 40.25,10 36.39,6.14 JP2.4
LCD_5_R/W
  Top 0.25: JP2.5 39,2.85 39,6.86 41.15,9 49,9 54.03,14.03 U4.14
LCD_6_EN
  Top 0.25: U4.15 54.53,13.53 49,8 42.75,8 41.47,6.72 JP2.6
LCD_7_DB0
  Top 0.25: U4.16 55.03,13.03 49,7 45,7 44,6 JP2.7
LCD_8_DB1
  Top 0.25: U4.17 55.53,12.53 48.75,5.75 47.31,5.75 46.56,5 46.55,4.95 JP2.8
LCD_9_DB2
  Top 0.25: U4.18 56.03,12.03 49,5 49,2.87 JP2.9
LCD_10_DB3
  Top 0.25: U4.19 56.53,11.53 51.5,6.5 51.5,2.91 JP2.10
LCD_11_DB4
  Top 0.25: U4.20 57.03,10.78 54.25,8 54.25,2.86 JP2.11
LCD_12_DB5
  Top 0.25: U4.21 57.53,10.03 56.75,9.25 56.75,2.82 JP2.12
LCD_13_DB6
  Top 0.25: U4.22 58.03,7.97 59.25,6.75 JP2.13
LCD_14_DB7  (via drill 0.35)
  Top 0.25: U4.25 61.32,16.93 61.75,16.5
  Top 0.4: 61.75,16.5 v61.75,14.75
  Bottom 0.25: 61.75,2.82 JP2.14
  Bottom 0.4: v61.75,14.75 61.75,2.82
N$1  (via drill 0.35)
  Top 0.5: Q1.1 35.92,37.83 35.75,38 v35.75,38.75 | C5.2 42.54,39.96 | v42.25,40.25 42.54,39.96 | 42.54,39.96 43.54,39.96 44.25,39.25 44.25,34 43.73,33.48 R13.2
  Bottom 0.5: v35.75,38.75 37.75,40.75 41,40.75 41.5,40.25 v42.25,40.25
N$2  (via drill 0.35)
  Top 1: R1.2 v67.25,26.25
  Bottom 1: v67.25,26.25 69.75,26.25 70.25,25.75 70.25,20.5 70.75,20 72,20 JP1.1
N$3
  Top 1: JP1.9 73.95,33.05 R4.1
  Bottom 1: JP1.10 JP1.9
N$5
  Top 0.25: U4.3 51.27,21.43 50.25,22.45 50.25,24.15 49.65,24.75 49.25,24.75 48.8,25.2 48.8,30.2 48.45,30.55 R5.2
N$6
  Top 1: R3.1 71.78,30.1 JP1.8
  Bottom 1: JP1.8 JP1.7
N$7
  Top 0.25: U4.1 51.32,22.43 50.85,22.9 50.85,24.65 50.25,25.25 49.75,25.25 49.5,25.5 49.5,31 48.7,31.8 47.81,31.8 47.12,32.49 47.12,34.48 47.01,34.59 46.69,34.89 R17.2 45.77,34.81 R16.1
N$9
  Top 1: R7.2 67,32 67.5,31.5 67.51,29.25 JP1.4
N$10
  Top 0.2: U3.FB 10.25,3.5 L1.P$2
  pour Top: 14.25,3.5 14,3.25 7.72,3.25 7.72,6.25 12.15,6.25 12.7,5.7 12.7,4.6 13.05,4.25 13,4.25 14,3.5
N$11
  Top 0.25: R6.1 40.05,25.25 39.88,25.07 38.83,25.07 38.5,24.75 36.65,24.75 36.3,24.4 36.3,23.2 36.2,23.1 | 35.5,22.97 D4.2 35.07,23.1 36.2,23.1 | 36.2,23.1 35.95,22.85 U2.2
N$13
  Top 0.25: R21.2 41.4,19.1 43.1,19.1 43.5,19.5 49.5,19.5 49.93,19.93 U4.6
N$14
  Top 0.25: 33.75,2.88 JP2.3
  Top 0.75: 33.75,2.88 33.75,7 32.75,8 32.75,11.75 33.92,12.92 TM1.2
N$15
  Top 0.5: R13.1 38.75,33.5 38,32.75 37.99,31.44 | 37.99,31.44 38.43,31 R14.1 | D1.1 37.99,31.44
N$16
  Top 0.25: 26.9,22.08 R30.1 | R30.1 28.48,22.25 28.72,22.49 Q2.1 | R30.1 27.06,19.66 R2.2 C17.1
N$17
  Top 0.25: X2.P$01 48.5,21.8 48.6,21.7 | 48.6,21.7 48.7,21.6 49.5,21.6 50.67,20.43 U4.5 | C22.2 42.85,21.45 43.1,21.7 48.6,21.7
N$18
  Top 0.25: X2.P$03 43.1,20.5 43,20.4 39.75,20.4 39.52,20.18 | 39.52,20.18 39.35,20 R21.1 | 39.52,20.18 39.1,20.6 C23.2
N$19
  Top 0.152: 35.44,25.39 D4.1
  Top 0.25: Q2.3 29.88,25 31.5,25 31.84,25.34 35.16,25.34 | R29.1 R31.1 35.05,26.39 D4.1 35.16,25.34 | 35.16,25.34 35.27,25.2 | 35.16,25.34
N$20
  Top 0.25: Q2.2 31.59,22.84 | 31.59,22.84 32,23.25 32.67,23.25 D3.P$1 | 31.59,22.84 31.93,22.5 32.5,22.5 32.65,22.35 C21.1
N$21  (via drill 0.35)
  Top 0.25: U5.P$11 54.5,29.5 55,29 v55.5,29 | v54.5,37.25 C25.1
  Top 0.5: R38.1 52.55,38.55 C25.1
  Bottom 0.25: v55.5,29 55.5,31 52.5,34 52.5,35.25 v54.5,37.25
N$22  (via drill 0.35)
  Top 0.25: U5.P$9 53.5,29.25 53.25,29 v52.75,29 | v47.25,35.65 47.35,35.75 48.75,35.75
  Top 0.5: R37.1 48,37.75 48.75,37 48.75,35.75 C26.1
  Bottom 0.25: v52.75,29 50.75,29 47.25,32.5 v47.25,35.65
N$23  (via drill 0.35)
  Top 0.25: R36.2 58.75,38 v59.25,37.5 | U5.P$5 54,35.05 v53.8,35.25
  Top 0.5: R36.2 58.8,38.55 C27.1
  Bottom 0.25: v59.25,37.5 58.75,37 55.5,37 v53.8,35.25
N$24  (via drill 0.35)
  Top 0.25: R35.2 v63.25,37.75 | U5.P$3 55,34.25 v55.25,34.5
  Top 0.5: R35.2 64.5,39 64.5,38.95 64.95,38.5 65.7,38.5 C28.1
  Bottom 0.25: v63.25,37.75 61.75,36 56.75,36 v55.25,34.5
N$26
  Top 0.25: C29.1 52.25,35.75 52.5,35.75 52.75,36 56.25,36 56.75,35.5 56.75,32.91 56.75,32.75 56.75,32.5 U5.P$1 R34.2
N$31
  Top 0.2: D2.2 1.5,27.5 1.5,27.25
  Top 0.305: 1.5,27.25 1,28 1.5,28.75 21.5,28.75 22.75,30 U1.STAT
N$32
  Top 0.305: U1.NC R19.2
N$33
  Top 0.305: D2.1 R24.1
N$34
  Top 0.25: U1.PROG 24.27,30.02
  Top 0.305: R23.2 26.05,28.76 24.27,30.02
N$35
  Top 0.25: R25.2 19.54,4 U3.NC
N$36
  Top 0.25: R26.2 11.29,18.54 11.28,18.55 CONN1.NC
N$38
  Top 0.25: R27.2 12.69,17.89 CONN1.TX
N$39
  Top 0.25: 11.74,17.24 11.75,17.25 | 11.74,17.24 13.51,17.24 R28.2 | CONN1.RX 11.73,17.25 11.74,17.24
OSC32_IN
  Top 0.25: X1.P$1 47.55,28.1 R5.1 46.6,28.65 46,29.25 46,30.25 45.7,30.55 C6.2
OSC32_OUT
  Top 0.25: U4.4 50.98,20.93 49.8,22.1 49.8,23.89 49.59,24.1 48.5,24.1 X1.P$2 44.85,24.35 C18.2
PWR_SW  (via drill 0.35)
  Top 0.5: v32.75,35 32.19,34.44 | 32.19,34.44 R12.1 | 32.19,34.44 33.93,32.7 D1.2 | JP3.6 50.25,41.88 48.35,41.85 48,41.5 R37.2 | v41.75,41.75 41.25,41.75 41.25,41.5 40.75,41 40.11,41 C4.1
  Bottom 0.25: 43.65,43.6 43.52,43.6
  Bottom 0.5: 43.12,44 35.5,44 32.75,41.25 v32.75,35 | 43.52,43.6 41.75,41.83 v41.75,41.75
  Bottom 0.6: JP3.6 43.65,43.6 | 43.52,43.6 43.12,44
PWR_SW_DB  (via drill 0.35)
  Top 0.25: v55.6,28.05 56.53,27.07 U4.42 | v51.75,31 U5.P$8
  Bottom 0.25: v55.6,28.05 52.1,31 v51.75,31
Q1_D1
  Top 0.35: Q1.3 R11.1
  Top 0.4: 36.88,36 Q1.3
  Top 0.5: 36.88,36 37.5,36 38.25,36.75 38.25,37.5 38.58,37.83 | Q1.6 38.58,37.83 | 38.58,37.83 36.75,39.66 36.75,40.75 | 36.75,40.75 37.09,41.09 C4.2 | 36.75,40.75 36.41,41.09 C3.2
SENSOR_SIG_OP
  Top 0.25: U4.29 62.32,18.93 63.37,17.88 63.87,17.88 64.25,17.5
  Top 0.5: JP5.2 73.02,13.7 R15.2 65.89,13.75 64.75,13.75 64.25,14.25 64.25,17.5 64.63,17.88 C7.1
SW_DOWN  (via drill 0.35)
  Top 0.5: R35.1 62.1,41.65 60.15,41.65 59.9,41.9 58.83,41.9 58.75,42 58.57,42.18 JP3.3 | v68.25,42.75 R18.2
  Bottom 0.5: JP3.3 58.57,45.07 59.25,45.75 66.25,45.75 68.25,43.75 v68.25,42.75
SW_DOWN_DB  (via drill 0.35)
  Top 0.25: U4.40 57.53,25.03 57.51,27.75 57.46,27.99 v57.45,28.35 | U5.P$4 54.5,35 v54.75,35.25
  Bottom 0.25: v54.75,35.25 54.5,35 54.5,33.75 57.45,30.75 v57.45,28.35
SW_LEFT
  Top 0.5: JP3.5 53.5,41.82 53.2,41.5 52.75,41.5 52.5,41.25 R38.2 R22.2
SW_LEFT_DB
  Top 0.25: U5.P$10 54.08,29.94 54.08,28.88 56.03,26.38 U4.43
SW_RIGHT
  Top 0.5: JP3.4 56.03,41.78 56,41.75 56.5,41.25 R20.2 R36.1
SW_RIGHT_DB  (via drill 0.35)
  Top 0.25: U4.41 57.03,27.28 56.4,27.9 v56.4,28.5 | v53.25,34.5 53.5,34.25 U5.P$6
  Bottom 0.25: v56.4,28.5 56.4,31.1 53.25,34.25 v53.25,34.5
SW_UP  (via drill 0.35)
  Top 0.25: R34.1 v59.5,34.5 60,34 R10.2
  Bottom 0.25: JP3.2 61.11,41.89 64.5,38.5 64.5,35.75 63.5,34.75 59.75,34.75 v59.5,34.5
SW_UP_DB  (via drill 0.35)
  Top 0.25: U4.39 58.03,24.78 58,27.25 | 58,27.25 58,27 | 58,27.25 59.75,29 v59.75,30 | U5.P$2 55.52,33.5 56,33.5 56.1,33.65 v56.1,34.15
  Bottom 0.25: v56.1,34.15 57.6,34.15 58,33.75 59.75,31.85 v59.75,30
VBATT+  (via drill 0.35)
  Top 0.25: 22.75,34.25 U1.VBATT2 | 22.75,34.25 23.25,34.01 U1.VBATT | 24.75,36 26,36 | 26,36 27.56,34.44 29,34.44 29,33.25 32.05,30.2 v32.04,26.99 | 26,36 33.25,36 | 30,41.25 24.75,36 | 30,41.25 30,43 31,44 41,44 | C3.1 30.16,41.09 30,41.25 | U3.VIN 17.75,5 18,5.25 18,6.25 18.15,6.25 18.45,6.55 18.72,6.57 C1.1 18.97,6.75 | CN1.1 22.27,35.77 | 22.27,35.77 22.5,36 24.75,36 | 22.27,35.77 22.27,34.73 22.75,34.25
  Top 0.35: Q1.2 36.14,36.88 35.25,36 33.25,36 34.81,34.44
  Top 0.5: 41,44 45.75,39.25 45.75,39.07 R16.2
  Top 1: 29,34.44 R12.2 | 34.81,34.44 R11.2 | v21.75,6.75 18.97,6.75
  pour Top: 10.75,36 11.75,35 19.1,34.9 22.3,34.9 22.85,35.5 24.25,35.5 25.5,34.25 26.75,34.25 29.75,30.5 31,27 31.5,26.5 32.5,26.5 33,27 33,30 30.25,33 30.25,35.75 30.5,36 34,36 34.75,36.75 34.75,38.75 33,40.25 33,41.75 34,42.5 34.25,42.5 41.6,42.55 42.5,43.5 42.5,44.5 42.25,44.75 15,44.75 10.75,41.25
  pour Bottom (rank 2): 31.75,27.5 32.5,27.5 32.75,27.25 32.75,19 26.75,13 26.75,4.75 25,3 23.75,3 20.75,5.25 20.75,16.25 30.5,26.25
VBATT+_SW  (via drill 0.35)
  Top 0.25: 42.5,36.93 C5.1
  Top 0.5: v37.6,24.1 36.9,23.4 U2.1 U2.5 | R29.2 v41,28.8 41.1,28.8 41.75,29.45 R14.2 | Q1.4 42.33,35.93 | 42.33,35.93 42.5,36.1 42.5,36.93 | 42.33,35.93 42.37,35.93 | 42.33,35.93 43,35.26 v43,34.9
  other vias: 68.5,11.8
  pour Top: 66,12.75 65,12.75 64.5,12.25 64.5,11.25 65,10.75 71,10.75 71.5,10.25 71.75,10 74.5,10 75.25,10.75 75.25,11.75 74.5,12.5 71.75,12.5 71.25,12.5 70.75,12.5 70.5,12.75
  pour Bottom: 44,35 43.5,35.5 42.5,35.5 39.5,32.5 39.5,30.75 36.5,27.75 36.5,21 42.5,15 42.75,15 46,11.75 67.25,11.75 68.25,10.75 69.5,12 69.5,12.5 65.75,16.25 60.75,16.25 58.5,14 48.25,14 39,23.25 39,26 44,31

### Text on the board
tPlace: Speed Demon -- Main PCB / Team 15 / (Rev.1) | Z.S. / N.D. | L.H. / A.C. | DNP | DNP